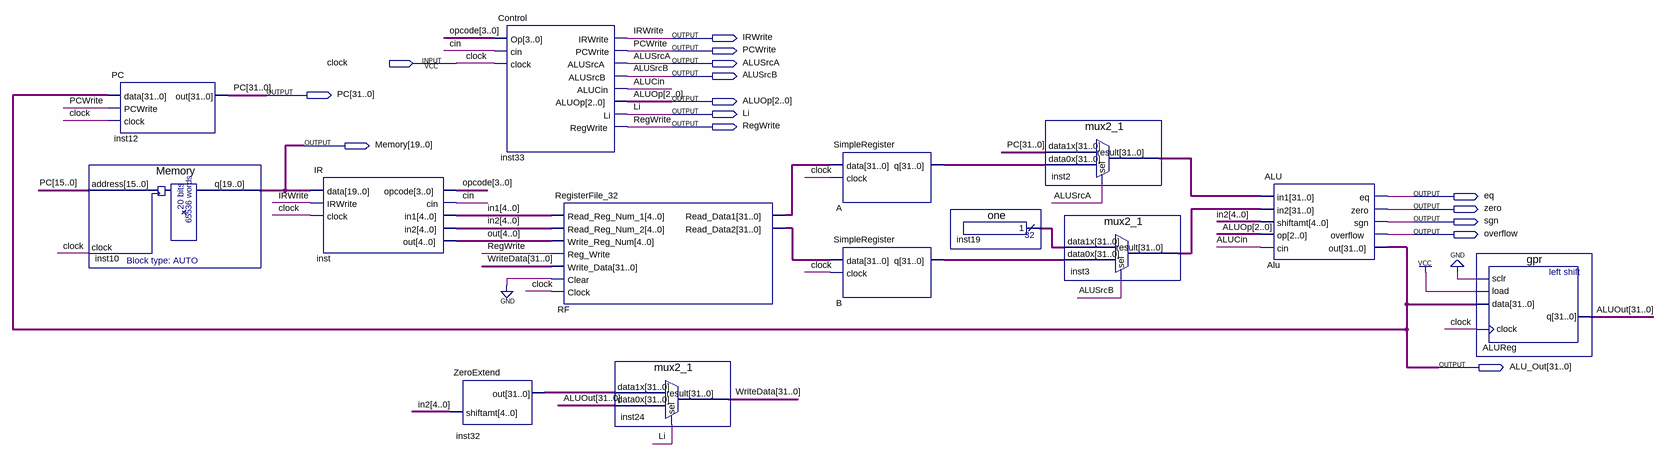
[diagram p0: schematic sheet]
// Quartus schematic Datapath.bdf as structural Verilog: 14 symbols, 15 pins
module Datapath (
  input  clock,
  output IRWrite,
  output PCWrite,
  output ALUSrcA,
  output ALUSrcB,
  output [31:0] PC,
  output [2:0] ALUOp,
  output Li,
  output RegWrite,
  output [19:0] Memory,
  output eq,
  output zero,
  output sgn,
  output overflow,
  output [31:0] ALU_Out
);

  wire ALUCin, cin;
  wire [3:0] opcode;
  wire [4:0] in1, in2, out;
  wire [31:0] A_q, ALUOut, B_q, inst2_result, inst3_result, inst19_result, inst32_out, RF_read_data1,
       RF_read_data2, WriteData;

  Memory inst10 (.address(PC[15:0]), .clock(clock), .q(Memory));
  PC inst12 (.data(ALU_Out), .PCWrite(PCWrite), .clock(clock), .out(PC));
  IR inst (
    .data(Memory), .IRWrite(IRWrite), .clock(clock), .opcode(opcode), .cin(cin), .in1(in1), .in2(in2),
    .out(out));
  ZeroExtend inst32 (.shiftamt(in2), .out(inst32_out));
  Control inst33 (
    .Op(opcode), .cin(cin), .clock(clock), .IRWrite(IRWrite), .PCWrite(PCWrite), .ALUSrcA(ALUSrcA),
    .ALUSrcB(ALUSrcB), .ALUCin(ALUCin), .ALUOp(ALUOp), .Li(Li), .RegWrite(RegWrite));
  RegisterFile_32 RF (
    .Read_Reg_Num_1(in1), .Read_Reg_Num_2(in2), .Write_Reg_Num(out), .Reg_Write(RegWrite),
    .Write_Data(WriteData), .Clear(1'b0), .Clock(clock), .Read_Data1(RF_read_data1),
    .Read_Data2(RF_read_data2));
  mux2_1 inst24 (.data1x(inst32_out), .data0x(ALUOut), .sel(Li), .result(WriteData));
  SimpleRegister A (.data(RF_read_data1), .clock(clock), .q(A_q));
  SimpleRegister B (.data(RF_read_data2), .clock(clock), .q(B_q));
  one inst19 (.result(inst19_result));
  mux2_1 inst2 (.data1x(PC), .data0x(A_q), .sel(ALUSrcA), .result(inst2_result));
  mux2_1 inst3 (.data1x(inst19_result), .data0x(B_q), .sel(ALUSrcB), .result(inst3_result));
  ALU Alu (
    .in1(inst2_result), .in2(inst3_result), .shiftamt(in2), .op(ALUOp), .cin(ALUCin), .eq(eq), .zero(zero),
    .sgn(sgn), .overflow(overflow), .out(ALU_Out));
  gpr ALUReg (.sclr(1'b0), .load(1'b1), .data(ALU_Out), .clock(clock), .q(ALUOut));
endmodule
